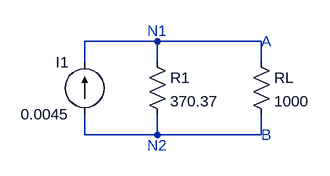
[diagram p0: schematic Norton.asc]
Norton.asc, the LTspice schematic file:
Version 4
SHEET 1 880 680
WIRE 128 112 16 112
WIRE 288 112 128 112
WIRE 16 144 16 112
WIRE 128 144 128 112
WIRE 288 144 288 112
WIRE 16 256 16 224
WIRE 128 256 128 224
WIRE 128 256 16 256
WIRE 288 256 288 224
WIRE 288 256 128 256
SYMBOL current 16 224 R180
WINDOW 0 24 80 Left 2
WINDOW 3 24 0 Left 2
WINDOW 123 0 0 Left 2
WINDOW 39 0 0 Left 2
SYMATTR InstName I1
SYMATTR Value 0.0045
SYMBOL res 112 128 R0
SYMATTR InstName R1
SYMATTR Value 370.37
SYMBOL res 272 128 R0
SYMATTR InstName RL
SYMATTR Value 1000
TEXT 112 96 Left 2 ;N1
TEXT 112 272 Left 2 ;N2
TEXT 288 112 Left 2 ;A
TEXT 288 256 Left 2 ;B

The netlist it stands for:
* Norton.asc
I1 N002 N001 0.0045
R1 N001 N002 370.37
RL N001 N002 1000
* N1
* N2
* A
* B
.backanno
.end